# Altium schematic sheet Tiresias_MCU.SchDoc: MCU
size 393 x 281 mm; Author: João Victor Colombari Carlet; CompanyName: GMETA; DrawnBy: João Victor Colombari Carlet; Organization: GMETA; Address1: EESC - USP; Address2: 400, Trabalhador São-Carlense Av.; Address3: 13566-590, São Carlos; Address4: São Paulo, Brazil; Revision: 0; SheetNumber: 2; SheetTotal: 5; Address_Website: http://www.sel.eesc.usp.br/jcarmo/metamaterials/
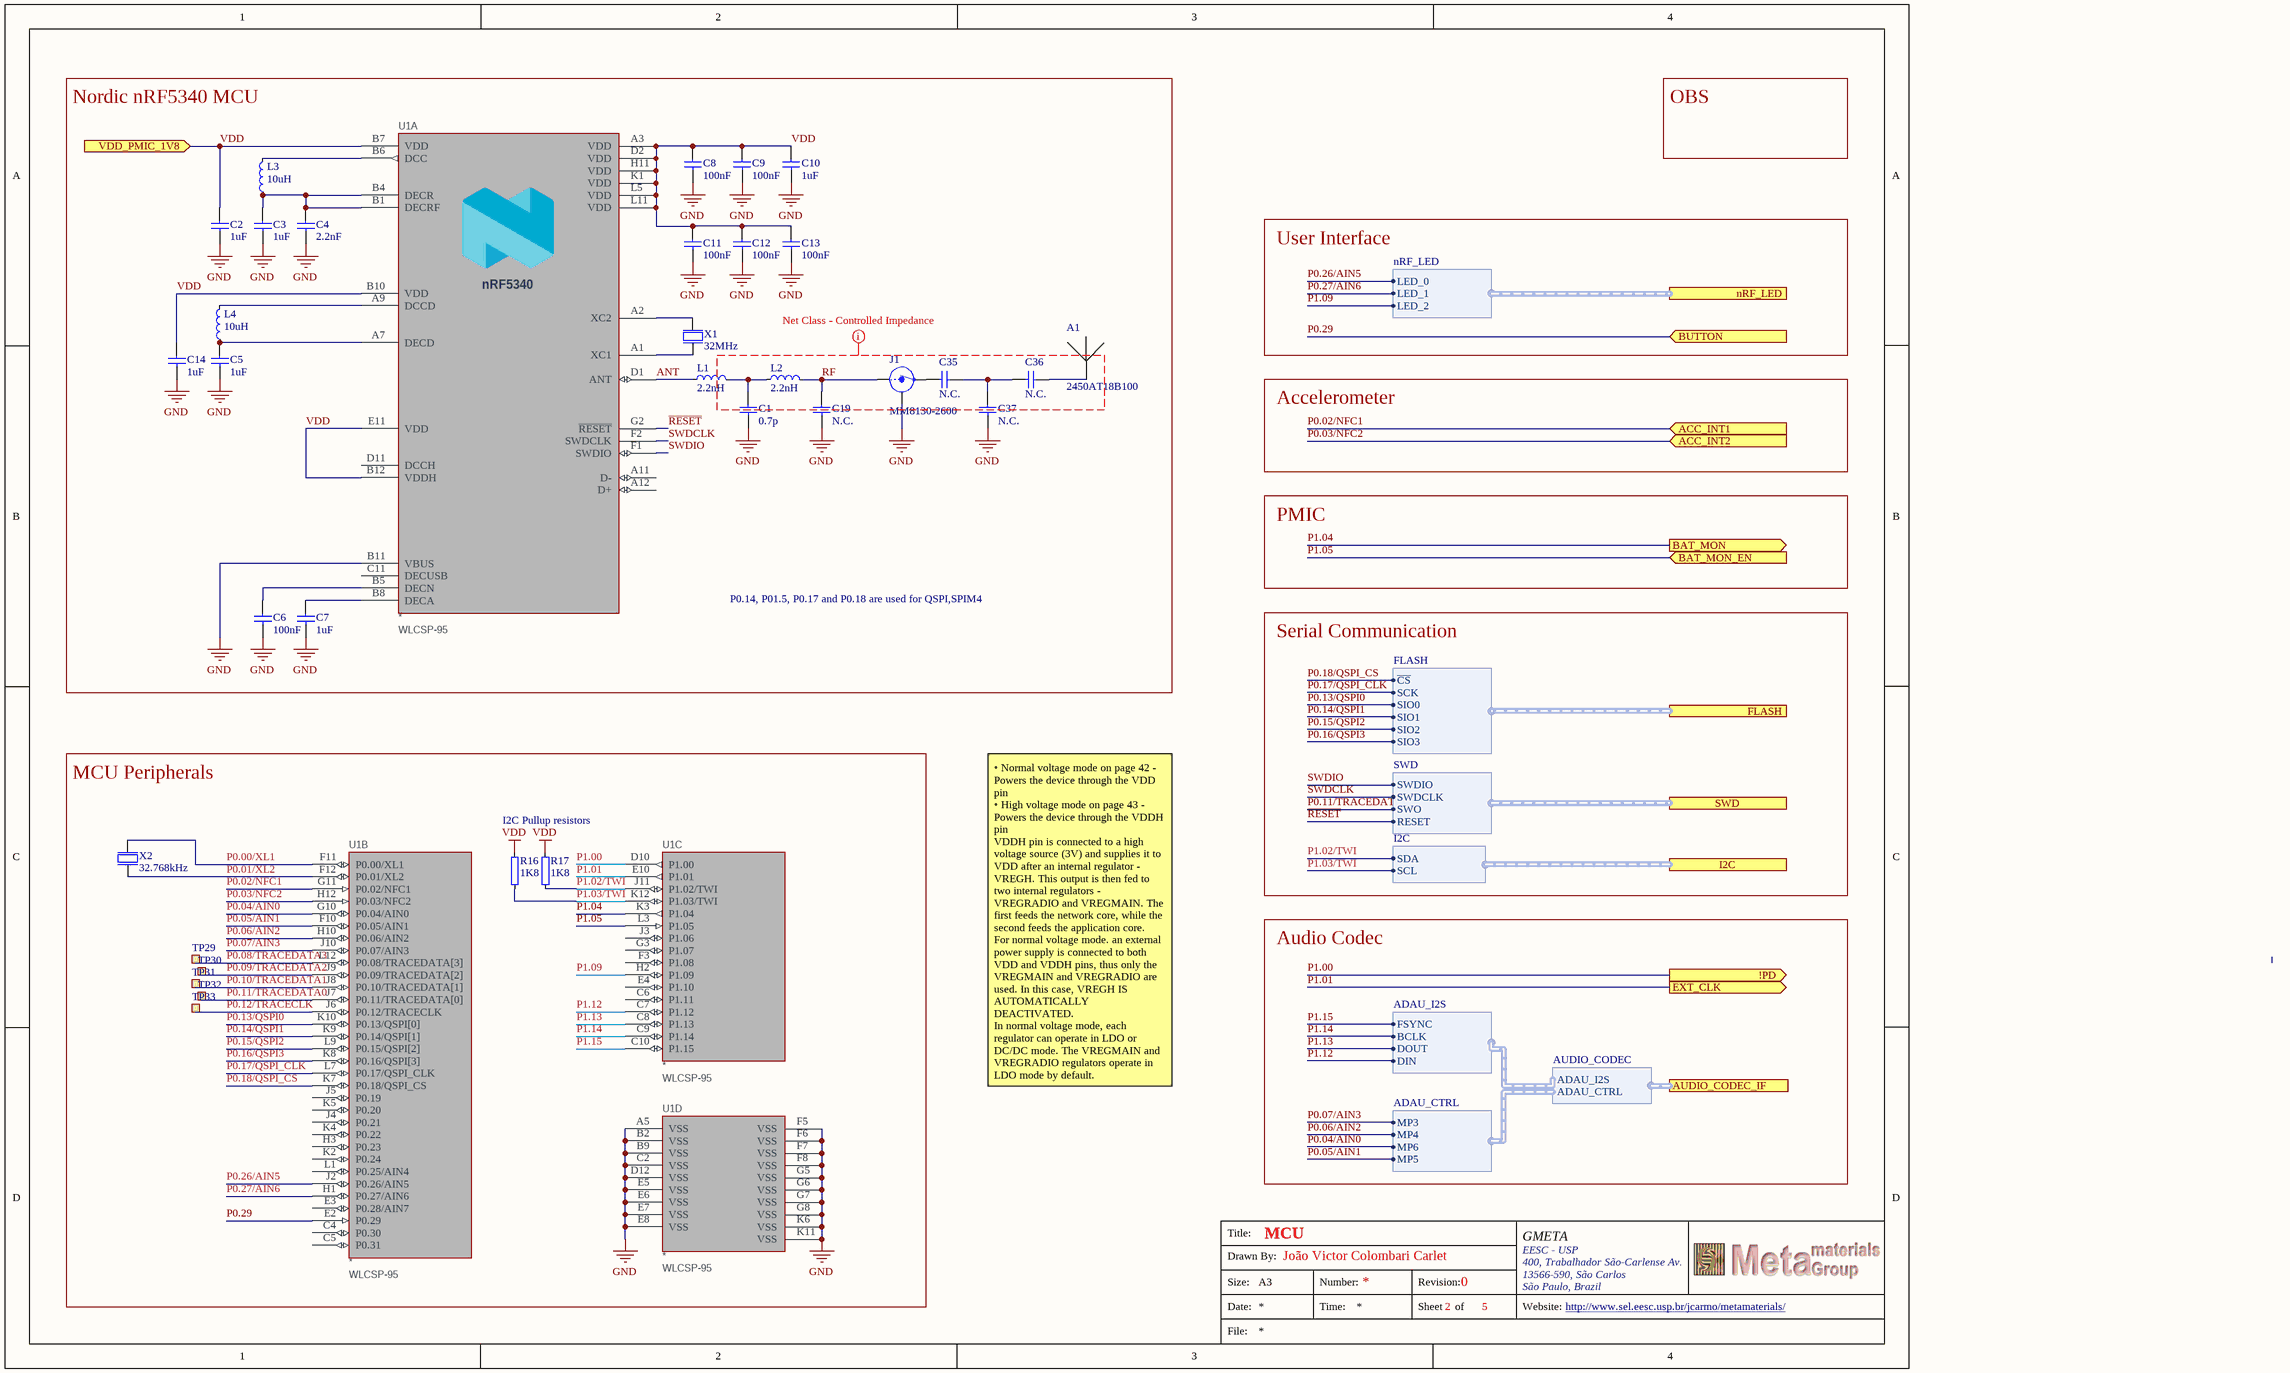
[diagram p0: Tiresias_MCU.SchDoc]

## Parts
A1  2450AT18B100  [2450AT18B100]
C1  0.7p  [CAPC0603X03L_C]
C2  1uF  [CAPC1005X04L]
C3  1uF  [CAPC1005X04L]
C4  2.2nF  [CAPC0603X03L_C]
C5  1uF  [CAPC1005X04L]
C6  100nF  [CAPC0603X03L_C]
C7  1uF  [CAPC1005X04L]
C8  100nF  [CAPC0603X03L_C]
C9  100nF  [CAPC0603X03L_C]
C10  1uF  [CAPC1005X04L]
C11  100nF  [CAPC0603X03L_C]
C12  100nF  [CAPC0603X03L_C]
C13  100nF  [CAPC0603X03L_C]
C14  1uF  [CAPC1005X04L]
C19  N.C.  [CAPC0603X03L_C_NC]
C35  N.C.  [CAPC0603X03L_C_NC]
C36  N.C.  [CAPC0603X03L_C_NC]
C37  N.C.  [CAPC0603X03L_C_NC]
J1  MM8130-2600  [COAXIAL-SWF]
L1  2.2nH  [INDC0603X03L_C]
L2  2.2nH  [INDC0603X03L_C]
L3  10uH  [INDC1608X06L]
L4  10uH  [INDC1608X06L]
R16  1K8  [RESC0603X03L_C]
R17  1K8  [RESC0603X03L_C]
TP29  Ø1.0mm,SMD  [TP_SMD_D1.0mm]  (value not drawn)  (no BOM)
TP30  Ø1.0mm,SMD  [TP_SMD_D1.0mm]  (value not drawn)  (no BOM)
TP31  Ø1.0mm,SMD  [TP_SMD_D1.0mm]  (value not drawn)  (no BOM)
TP32  Ø1.0mm,SMD  [TP_SMD_D1.0mm]  (value not drawn)  (no BOM)
TP33  Ø1.0mm,SMD  [TP_SMD_D1.0mm]  (value not drawn)  (no BOM)
U1  *  Package: WLCSP-95  [BGA95C35P12X11_437X397X50]  (parts A,B,C,D of 4)
X1  32MHz  [BT-XTAL_2016]
X2  32.768kHz  [XTAL_2012]

## Blocks framed on the sheet
Nordic nRF5340 MCU: A1 C1-C14 C19 C35-C37 J1 L1-L4 U1 X1
MCU Peripherals: R16 R17 TP29-TP33 U1 X2

## Ports
!PD (out, see Tiresias_Cover_letter[3C], Tiresias_audio_codec[1C]), ACC_INT1 (in, see Tiresias_Cover_letter[3C], Tiresias_misc[4D]), ACC_INT2 (in, see Tiresias_Cover_letter[3C], Tiresias_misc[4C]), AUDIO_CODEC_IF (harness AUDIO_CODEC, see Tiresias_Cover_letter[3C], Tiresias_audio_codec[3B]), BAT_MON (out, see Tiresias_Cover_letter[3C], Tiresias_PMIC[1C]), BAT_MON_EN (in, see Tiresias_Cover_letter[3C], Tiresias_PMIC[2C]), BUTTON (in, see Tiresias_Cover_letter[3C], Tiresias_misc[2B]), EXT_CLK (out, see Tiresias_Cover_letter[3C], Tiresias_audio_codec[2D]), FLASH (harness FLASH, see Tiresias_Cover_letter[3C], Tiresias_misc[3C]), I2C (harness I2C, see Tiresias_Cover_letter[3C], Tiresias_audio_codec[3C], Tiresias_misc[2C]), nRF_LED (harness nRF_LED, see Tiresias_Cover_letter[3C], Tiresias_misc[1B]), SWD (harness SWD, see Tiresias_Cover_letter[3C], Tiresias_misc[2A]), VDD_PMIC_1V8 (in, see Tiresias_Cover_letter[3B], Tiresias_misc[1A])

## Harnesses
SWD: SWDIO, SWDCLK, SWO, RESET
FLASH: ~{CS}, SCK, SIO0, SIO1, SIO2, SIO3
ADAU_I2S: FSYNC, BCLK, DOUT, DIN
ADAU_CTRL: MP3, MP4, MP6, MP5
AUDIO_CODEC: ADAU_I2S, ADAU_CTRL
I2C: SDA, SCL
nRF_LED: LED_0, LED_1, LED_2

## Nets
GND: C1.1 C2.1 C3.1 C4.1 C5.1 C6.1 C7.1 C8.1 C9.1 C10.1 C11.1 C12.1 C13.1 C14.1 C19.1 C37.1 J1.2(Shield) U1.A5(VSS) U1.B2(VSS) U1.B9(VSS) U1.B11(VBUS) U1.C2(VSS) U1.D12(VSS) U1.E5(VSS) U1.E6(VSS) U1.E7(VSS) U1.E8(VSS) U1.F5(VSS) U1.F6(VSS) U1.F7(VSS) U1.F8(VSS) U1.G5(VSS) U1.G6(VSS) U1.G7(VSS) U1.G8(VSS) U1.K6(VSS) U1.K11(VSS) X1.2(GND) X1.4(GND)
VDD: C2.2 C8.2 C9.2 C10.2 C11.2 C12.2 C13.2 C14.2 R16.2 R17.2 U1.A3(VDD) U1.B7(VDD) U1.B10(VDD) U1.B12(VDDH) U1.D2(VDD) U1.E11(VDD) U1.H11(VDD) U1.K1(VDD) U1.L5(VDD) U1.L11(VDD) ; port VDD_PMIC_1V8
ANT: L1.1 U1.D1(ANT)
P0.00/XL1: U1.F11(P0.00/XL1) X2.2(out)
P0.01/XL2: U1.F12(P0.01/XL2) X2.1(inp)
P0.02/NFC1: U1.G11(P0.02/NFC1) ; port ACC_INT1
P0.03/NFC2: U1.H12(P0.03/NFC2) ; port ACC_INT2
P0.04/AIN0: U1.G10(P0.04/AIN0) ; harness ADAU_CTRL.MP6
P0.05/AIN1: U1.F10(P0.05/AIN1) ; harness ADAU_CTRL.MP5
P0.06/AIN2: U1.H10(P0.06/AIN2) ; harness ADAU_CTRL.MP4
P0.07/AIN3: U1.J10(P0.07/AIN3) ; harness ADAU_CTRL.MP3
P0.08/TRACEDATA3: TP29.1 U1.L12(P0.08/TRACEDATA[3])
P0.09/TRACEDATA2: TP30.1 U1.J9(P0.09/TRACEDATA[2])
P0.10/TRACEDATA1: TP31.1 U1.J8(P0.10/TRACEDATA[1])
P0.11/TRACEDATA0: TP32.1 U1.J7(P0.11/TRACEDATA[0]) ; port SWD.SWO
P0.12/TRACECLK: TP33.1 U1.J6(P0.12/TRACECLK)
P0.13/QSPI0: U1.K10(P0.13/QSPI[0]) ; port FLASH.SIO0
P0.14/QSPI1: U1.K9(P0.14/QSPI[1]) ; port FLASH.SIO1
P0.15/QSPI2: U1.L9(P0.15/QSPI[2]) ; port FLASH.SIO2
P0.16/QSPI3: U1.K8(P0.16/QSPI[3]) ; port FLASH.SIO3
P0.17/QSPI_CLK: U1.L7(P0.17/QSPI_CLK) ; port FLASH.SCK
P0.18/QSPI_CS: U1.K7(P0.18/QSPI_CS) ; port FLASH.~{CS}
P0.26/AIN5: U1.J2(P0.26/AIN5) ; port nRF_LED.LED_0
P0.27/AIN6: U1.H1(P0.27/AIN6) ; port nRF_LED.LED_1
P0.29: U1.E2(P0.29) ; port BUTTON
P1.00: U1.D10(P1.00) ; port !PD
P1.01: U1.E10(P1.01) ; port EXT_CLK
P1.02/TWI: R17.1 U1.J11(P1.02/TWI) ; port I2C.SDA
P1.03/TWI: R16.1 U1.K12(P1.03/TWI) ; port I2C.SCL
P1.04: U1.K3(P1.04) ; port BAT_MON
P1.05: U1.L3(P1.05) ; port BAT_MON_EN
P1.09: U1.H2(P1.09) ; port nRF_LED.LED_2
P1.12: U1.C7(P1.12) ; harness ADAU_I2S.DIN
P1.13: U1.C8(P1.13) ; harness ADAU_I2S.DOUT
P1.14: U1.C9(P1.14) ; harness ADAU_I2S.BCLK
P1.15: U1.C10(P1.15) ; harness ADAU_I2S.FSYNC
~{RESET}: U1.G2(~{RESET}) ; port SWD.RESET
RF: C19.2 J1.1(IN) L2.2
SWDCLK: U1.F2(SWDCLK) ; port SWD.SWDCLK
SWDIO: U1.F1(SWDIO) ; port SWD.SWDIO
NetA1_1: A1.1 C36.1
NetC1_2: C1.2 L1.2 L2.1
NetC3_2: C3.2 C4.2 L3.1 U1.B1(DECRF) U1.B4(DECR)
NetC5_2: C5.2 L4.1 U1.A7(DECD)
NetC6_2: C6.2 U1.B5(DECN)
NetC7_2: C7.2 U1.B8(DECA)
NetC35_1: C35.1 J1.3(OUT)
NetC35_2: C35.2 C36.2 C37.2
NetL3_2: L3.2 U1.B6(DCC)
NetL4_2: L4.2 U1.A9(DCCD)
NetU1_A1: U1.A1(XC1) X1.1(inp)
NetU1_A2: U1.A2(XC2) X1.3(out)

Not connected (* = marked no-connect by the designer): U1 A11(D-) A12(D+) C4(P0.30) C5(P0.31) C6(P1.11) C11(DECUSB) D11(DCCH) E3(P0.28/AIN7) E4(P1.10) F3(P1.08) G3(P1.07) H3(P0.23) J3(P1.06) J4(P0.21) J5(P0.19) K2(P0.24) K4(P0.22) K5(P0.20) L1(P0.25/AIN4)

## Layout directives
net class controlled_impedance: RF

## Notes on the sheet
- OBS
- User Interface
- Accelerometer
- PMIC
- P0.14, P01.5, P0.17 and P0.18 are used for QSPI,SPIM4
- Serial Communication
- I2C Pullup resistors
- Audio Codec
- • Normal voltage mode on page 42 - Powers the device through the VDD pin
  • High voltage mode on page 43 - Powers the device through the VDDH pin
  VDDH pin is connected to a high voltage source (3V) and supplies it to VDD after an internal regulator - VREGH. This output is then fed to two internal regulators - VREGRADIO and VREGMAIN. The first feeds the network core, while the second feeds the application core.
  For normal voltage mode. an external power supply is connected to both VDD and VDDH pins, thus only the VREGMAIN and VREGRADIO are used. In this case, VREGH IS AUTOMATICALLY DEACTIVATED.
  In normal voltage mode, each regulator can operate in LDO or DC/DC mode. The VREGMAIN and VREGRADIO regulators operate in LDO mode by default.
  Operating a regulator in DC/DC mode reduces the overall power consumption due to higher efficiency than in LDO mode.
- Title:
- Drawn By:
- Size:
- Date:
- File:
- A3
- Number:
- Time:
- Revision:
- Sheet
- of
- Website:
- (in symbol nRF5340-CLAA, part A) nRF5340

## Library data of the parts
A1 = Johanson 2450AT18B100: 2.45 GHz chip antenna; Manufacturer: Johanson Technology; Part number IPS: 00000007781; Note: N.A.; Pad Count: 2; Part Number: Johanson 2450AT18B100; Manufacturer Part Number: 2450AT18B100; ComponentLink1URL: N.A.; ComponentLink1Description: Datasheet; ComponentLink2URL: N.A.; ComponentLink2Description: Supplier link; HelpURL: http://www.johansontechnology.com/datasheets/antennas/2450AT18B100.pdf; Footprint Doc: 2450AT18B100; LatestRevisionDate: 2013-09-13; Published: 2013-09-13; Value: 2450AT18B100; Supplier 1: Digi-Key; Supplier Part Number 1: 712-1006-1-ND; Supplier 2: N.A.; Supplier Part Number 2: N.A.; Artikkelnr Noca: N.A.; Component Class: Antennas; PartId: 100700001; Author: rsk; Part number Norautron: N.A.
C1 = CAP_0201_0p7: Capacitor, NP0, ±2%; Part Number: C0201-0p7; Class: SMT; Manufacturer: *; Manufacturer Part Number: *; LatestRevisionDate: 2024-03-04; Value: 0.7p; Package: 0201; Pin Count: 2; JLCpcb link: *; Mouser link: *; DigiKey link: *
C2 C3 C5 C7 C10 C14 = CAP_0402_1uF: Capacitor, X5R, ±5%; Part Number: C0402-1µ0; Class: SMT; Manufacturer: *; Manufacturer Part Number: *; LatestRevisionDate: 2024/02/20; Value: 1uF; Package: 0402; Pin Count: 2
C4 = CAP_0201_2n2: Capacitor, NP0, ±2%; Part Number: C0201-2n2; Class: SMT; Manufacturer: *; Manufacturer Part Number: *; LatestRevisionDate: 2024/03/02; Package: 0201; Pin Count: 2; JLCpcb link: *; Mouser link: *; DigiKey link: *; Value: 2.2nF
C6 C8 C9 C11-C13 = CAP_0201_100nF: Capacitor, NP0, ±2%; Part Number: C0201-100n; Class: SMT; Manufacturer: *; Manufacturer Part Number: *; LatestRevisionDate: 2024/02/20; Value: 100nF; Package: 0201; Pin Count: 2; JLCpcb link: *; Mouser link: *; DigiKey link: *
C19 C35-C37 = CAP_0201_NC: Capacitor, NP0, ±2%; Part Number: C0201-NC; Manufacturer: *; Manufacturer Part Number: *; LatestRevisionDate: 2024-03-04; Value: N.C.; Package: *; Pin Count: 2; Class: *; JLCpcb link: *; Mouser link: *; DigiKey link: *
J1 = MM8130-2600: Coaxial Connector with Switch; Manufacturer: Murata; Part number IPS: 00000009955; Note: N.A.; Artikkelnr Noca: 55029011; Pad Count: 3; Part Number: MM8130-2600; Manufacturer Part Number: MM8130-2600; LatestRevisionDate: 2014-04-24; Published: 2014-04-24; Value: MM8130-2600; Footprint Doc: COAXIAL-SWF; ComponentLink1URL: N.A.; ComponentLink1Description: Datasheet; ComponentLink2URL: N.A.; ComponentLink2Description: Supplier link; HelpURL: http://www.murata.com/products/catalog/pdf/o33e.pdf; Supplier 1: Digi-Key; Supplier Part Number 1: 490-4981-1-ND; Supplier 2: Mouser; Supplier Part Number 2: 81-MM8130-2600RA2; PartId: 100500400; Component Class: Connectors; Author: rsk; Part number Norautron: N.A.
L1 L2 = IND_0201_2n2H: High frequency chip inductor ±5%; Part Number: L0201-2n2; Class: SMT; Manufacturer: *; Manufacturer Part Number: *; LatestRevisionDate: 2024/02/20; Value: 2.2nH; Package: 0201; Pin Count: 2
L3 L4 = IND_0603_10uH: Chip inductor, IDC,min = 50 mA, ±20%; Part Number: L0603-10µ; Class: SMT; LatestRevisionDate: 2024/02/20; Value: 10uH; Package: 0603; Pin Count: 2
R16 R17 = RES_0201_1K8: Resistor, ±1%, 0.05W; Part Number: R0201-100k; Manufacturer: N.A.; Class: SMT; Latest Revision Date: 2024-04-23; ComponentLink1URL: N.A.; ComponentLink1Description: Datasheet; ComponentLink2URL: N.A.; ComponentLink2Description: Supplier link; Value: 1K8; Package: 0201; Pin Count: 2; JLCpcb link: Chip Res 1%; Mouser link: N.A.; DigiKey link: 00000001419; Author: rsk
TP29-TP33 = TP_SMD_Ø1.0MM: 1.0mm circular SMD testpad; Manufacturer: Nordic Semiconductor; Manufacturer Part Number: N.A.; Pad Count: 1; Part Number: TP_SMD_Ø1.0MM; ComponentLink1URL: N.A.; ComponentLink1Description: Datasheet; ComponentLink2URL: N.A.; ComponentLink2Description: Supplier link; HelpURL: N.A.; Footprint Doc: TP_SMD_Ø1.0mm; LatestRevisionDate: 2021-03-05; Published: 2013-06-11; Value: Ø1.0mm,SMD; Note: N.A.; Supplier 1: N.A.; Supplier Part Number 1: N.A.; Supplier 2: N.A.; Supplier Part Number 2: N.A.; Artikkelnr Noca: N.A.; Part number IPS: N.A.; Component Class: Connectors; PartId: 100500475; Author: rsk; Part number Norautron: N.A.
U1 = nRF5340-CLAA: Multi-protocol Bluetooth Low Energy, IEEE 802.15.4, ANT and 2.4GHz proprietary system-on-chip; Manufacturer: Nordic Semiconductors; Class: logic; Part Number: nRF5340-CLAA; Manufacturer Part Number: nRF5340-CLAA; Latest Revision Date: 2024/03/04; Value: *; Pin Count: 95; JLCpcb link: *; Mouser link: *; DigiKey link: *
X1 = XTAL_SMD2016_32MHz: XTAL SMD 2016, 32MHz, Cl=8pF, Total Tol: ±40ppm; Part Number: XTAL_SMD2016_32MHz_8pF_General; Class: SMT; Manufacturer: *; Manufacturer Part Number: *; LatestRevisionDate: 2024/02/20; Value: 32MHz; Package: 2016; Pin Count: 4
X2 = XTAL_SMD2012_32k768Hz: XTAL SMD 2012, 32.768kHz, Cl=9pF, Total Tol: ±50ppm; Part Number: XTAL_SMD2012_32.768kHz_9pF_General; Class: SMT; Manufacturer: *; Manufacturer Part Number: *; LatestRevisionDate: 2024/02/20; Value: 32.768kHz; Package: 2012; Pin Count: 4